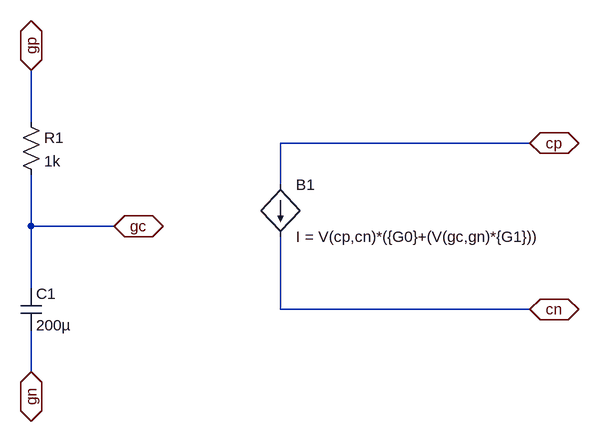
[diagram p0: schematic Symbole-Capteur.asc]
Symbole-Capteur.asc, the LTspice schematic file:
Version 4
SHEET 1 880 680
WIRE -368 16 -368 -64
WIRE 400 48 16 48
WIRE 16 112 16 48
WIRE -368 176 -368 96
WIRE -240 176 -368 176
WIRE -368 272 -368 176
WIRE 16 304 16 192
WIRE 400 304 16 304
WIRE -368 400 -368 336
FLAG 400 48 cp
IOPIN 400 48 BiDir
FLAG 400 304 cn
IOPIN 400 304 BiDir
FLAG -368 -64 gp
IOPIN -368 -64 BiDir
FLAG -368 400 gn
IOPIN -368 400 BiDir
FLAG -240 176 gc
IOPIN -240 176 BiDir
SYMBOL bi 16 112 R0
SYMATTR InstName B1
SYMATTR Value I = V(cp,cn)*({G0}+(V(gc,gn)*{G1}))
SYMBOL res -384 0 R0
SYMATTR InstName R1
SYMATTR Value 1k
SYMBOL cap -384 272 R0
SYMATTR InstName C1
SYMATTR Value 200µ

The netlist it stands for:
* Symbole-Capteur.asc
B1 cp cn I = V(cp,cn)*({G0}+(V(gc,gn)*{G1}))
R1 gp gc 1k
C1 gc gn 200µ
.backanno
.end